# EAGLE schematic musicbox mechanical-03 (EAGLE 9.6.2)
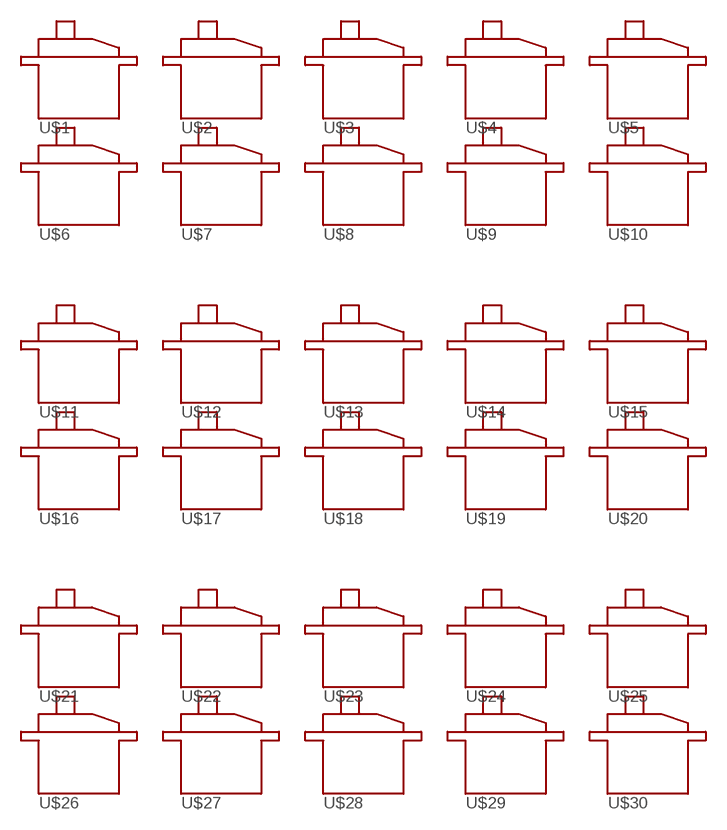
[diagram p0: schematic, sheet 1]

## Parts
U$1  SERVO-CUTOUT  [SERVO-CUTOUT]
U$2  SERVO-CUTOUT  [SERVO-CUTOUT]
U$3  SERVO-CUTOUT  [SERVO-CUTOUT]
U$4  SERVO-CUTOUT  [SERVO-CUTOUT]
U$5  SERVO-CUTOUT  [SERVO-CUTOUT]
U$6  SERVO-CUTOUT  [SERVO-CUTOUT]
U$7  SERVO-CUTOUT  [SERVO-CUTOUT]
U$8  SERVO-CUTOUT  [SERVO-CUTOUT]
U$9  SERVO-CUTOUT  [SERVO-CUTOUT]
U$10  SERVO-CUTOUT  [SERVO-CUTOUT]
U$11  SERVO-CUTOUT  [SERVO-CUTOUT]
U$12  SERVO-CUTOUT  [SERVO-CUTOUT]
U$13  SERVO-CUTOUT  [SERVO-CUTOUT]
U$14  SERVO-CUTOUT  [SERVO-CUTOUT]
U$15  SERVO-CUTOUT  [SERVO-CUTOUT]
U$16  SERVO-CUTOUT  [SERVO-CUTOUT]
U$17  SERVO-CUTOUT  [SERVO-CUTOUT]
U$18  SERVO-CUTOUT  [SERVO-CUTOUT]
U$19  SERVO-CUTOUT  [SERVO-CUTOUT]
U$20  SERVO-CUTOUT  [SERVO-CUTOUT]
U$21  SERVO-CUTOUT  [SERVO-CUTOUT]
U$22  SERVO-CUTOUT  [SERVO-CUTOUT]
U$23  SERVO-CUTOUT  [SERVO-CUTOUT]
U$24  SERVO-CUTOUT  [SERVO-CUTOUT]
U$25  SERVO-CUTOUT  [SERVO-CUTOUT]
U$26  SERVO-CUTOUT  [SERVO-CUTOUT]
U$27  SERVO-CUTOUT  [SERVO-CUTOUT]
U$28  SERVO-CUTOUT  [SERVO-CUTOUT]
U$29  SERVO-CUTOUT  [SERVO-CUTOUT]
U$30  SERVO-CUTOUT  [SERVO-CUTOUT]

## Library data of the parts
U$1-U$30 = music-box-parts:SERVO-CUTOUT